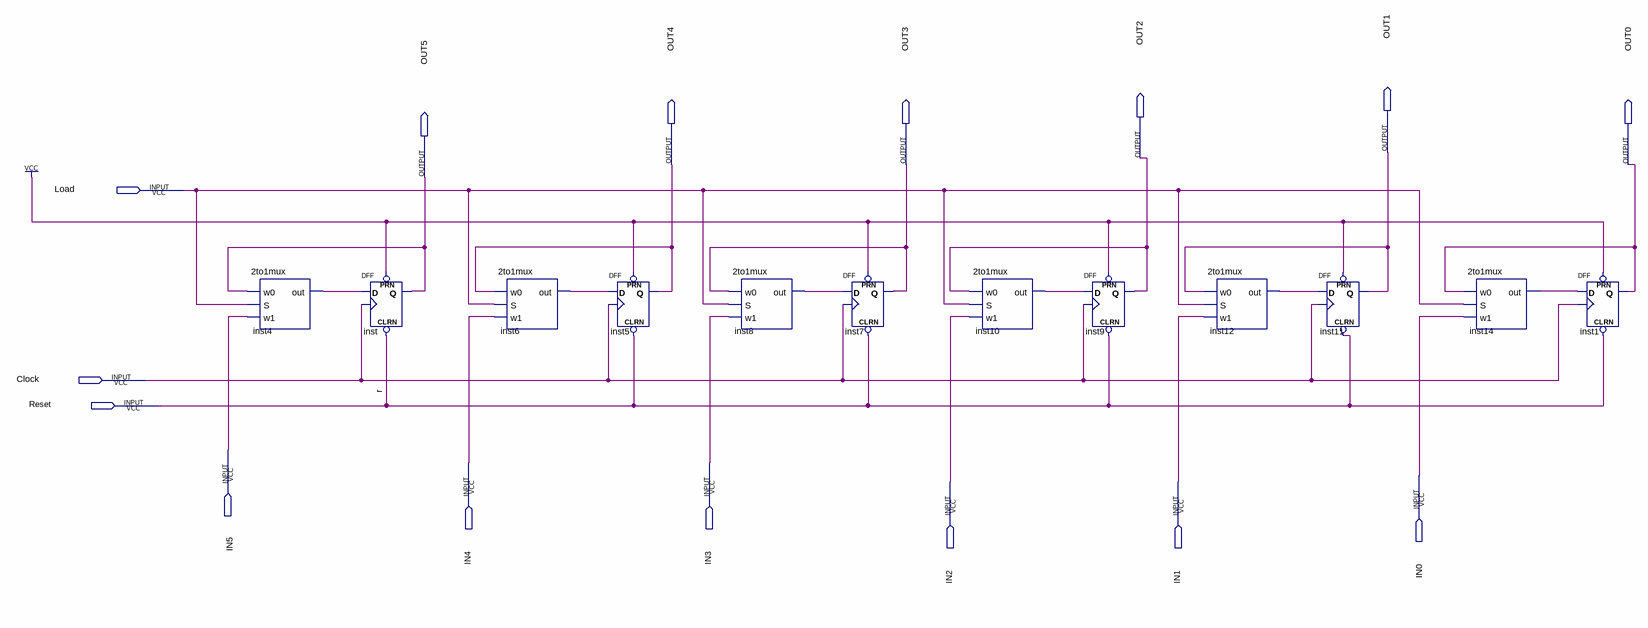
[diagram p0: schematic sheet]
// Quartus schematic single6bitregister.bdf as structural Verilog: 12 symbols, 15 pins
module single6bitregister (
  input  Load,
  input  Clock,
  input  Reset,
  input  IN5,
  input  IN4,
  input  IN3,
  input  IN0,
  input  IN2,
  input  IN1,
  output OUT1,
  output OUT2,
  output OUT4,
  output OUT3,
  output OUT0,
  output OUT5
);

  wire inst4_out, inst6_out, inst8_out, inst10_out, inst12_out, inst14_out;

  \2to1mux  inst4 (.w0(OUT5), .S(Load), .w1(IN5), .out(inst4_out));
  DFF inst (.CLRN(Reset), .CLK(Clock), .D(inst4_out), .PRN(1'b1), .Q(OUT5));
  \2to1mux  inst6 (.w0(OUT4), .S(Load), .w1(IN4), .out(inst6_out));
  DFF inst5 (.CLRN(Reset), .CLK(Clock), .D(inst6_out), .PRN(1'b1), .Q(OUT4));
  \2to1mux  inst8 (.w0(OUT3), .S(Load), .w1(IN3), .out(inst8_out));
  DFF inst7 (.CLRN(Reset), .CLK(Clock), .D(inst8_out), .PRN(1'b1), .Q(OUT3));
  \2to1mux  inst10 (.w0(OUT2), .S(Load), .w1(IN2), .out(inst10_out));
  DFF inst9 (.CLRN(Reset), .CLK(Clock), .D(inst10_out), .PRN(1'b1), .Q(OUT2));
  \2to1mux  inst12 (.w0(OUT1), .S(Load), .w1(IN1), .out(inst12_out));
  DFF inst11 (.CLRN(Reset), .CLK(Clock), .D(inst12_out), .PRN(1'b1), .Q(OUT1));
  \2to1mux  inst14 (.w0(OUT0), .S(Load), .w1(IN0), .out(inst14_out));
  DFF inst1 (.CLRN(Reset), .CLK(Clock), .D(inst14_out), .PRN(1'b1), .Q(OUT0));

  // Other names for the same wires on the sheet: r = Reset
endmodule
